# EAGLE design Driver-v1 (EAGLE 8.4.2)
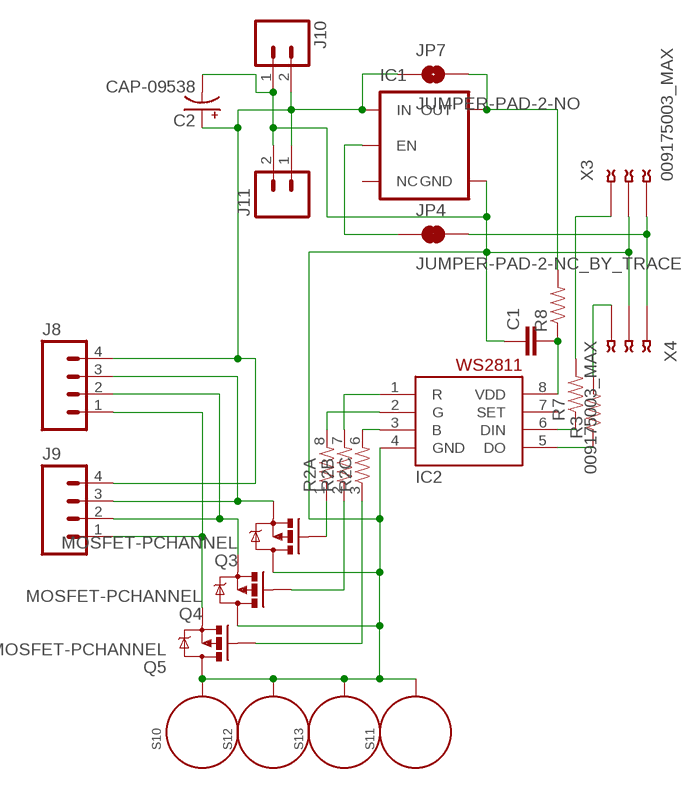
[diagram p0: schematic, sheet 1]

## Parts
C1  CAP1206  [1206]
C2  CAP-09538  1000UF-25V(PTH)  [CPOL-RADIAL-1000UF-25V]
IC1  V_REG_TPS76433SOT23-5  [SOT23-5]
IC2  WS2811-SOP8  [SO08-SKINNYPADS]
J8  M04LONGPADS  [1X04_LONGPADS]
J9  M04LONGPADS  [1X04_LONGPADS]
J10  M025MM  [SCREWTERMINAL-5MM-2]
J11  M025MM  [SCREWTERMINAL-5MM-2]
JP4  JUMPER-PAD-2-NC_BY_TRACE  [PAD-JUMPER-2-NC_BY_TRACE_YES_SILK]
JP7  JUMPER-PAD-2-NO  [PAD-JUMPER-2-NO_NO_SILK]
Q3  MOSFET-PCHANNEL  [SOT23-3]
Q4  MOSFET-PCHANNEL  [SOT23-3]
Q5  MOSFET-PCHANNEL  [SOT23-3]
R2  RESISTOR-ARRAY0603-ARV  [0603-ARV]
R3  RESISTOR0603  [0603-RES]
R7  RESISTOR0603  [0603-RES]
R8  RESISTOR0805-RES  [0805]
S10  STANDOFF_ELECTRICAL  [STANDOFF-ELECTRICAL]
S11  STANDOFF_ELECTRICAL  [STANDOFF-ELECTRICAL]
S12  STANDOFF_ELECTRICAL  [STANDOFF-ELECTRICAL]
S13  STANDOFF_ELECTRICAL  [STANDOFF-ELECTRICAL]
X3  009175003_MAX  [009175003_MAX]
X4  009175003_MAX  [009175003_MAX]

## Nets
GND2: C1.1 C2.- IC1.2(GND) IC2.4(GND) J10.1 J11.2 Q3.3(D) Q4.3(D) Q5.3(D) S10.P1 S11.P1 S12.P1 S13.P1 X3.2 X3.2@1 X4.2 X4.2@1
N$17: J8.1 J9.1 Q5.2(S)
N$20: J8.2 J9.2 Q4.2(S)
N$21: J8.3 J9.3 Q3.2(S)
N$22: Q3.1(G) R2.1
N$24: Q4.1(G) R2.2
N$26: Q5.1(G) R2.3
N$27: JP4.2 X3.3 X3.3@2 X4.1 X4.1@1
N$28: IC1.3(EN) JP4.1
N$29: R7.2 X3.1 X3.1@1
N$30: IC2.5(DO) R3.1
N$31: IC2.3(B) R2.6
N$32: IC2.2(G) R2.8
N$33: IC2.1(R) R2.7
N$34: IC1.5(OUT) JP7.2 R8.2
N$35: IC2.6(DIN) R7.1
N$36: R3.2 X4.3 X4.3@2
N$37: C1.2 IC2.8(VDD) R8.1
VIN2: C2.+ IC1.1(IN) J8.4 J9.4 J10.2 J11.1 JP7.1
Unconnected: IC1.4(NC) IC2.7(SET) R2.4 R2.5

## Library data of the parts
C1 = SparkFun-Passives:CAP: Capacitor Standard 0603 ceramic capacitor, and 0.1" leaded capacitor.
C2 = SparkFun-Capacitors:1000UF-25V(PTH): CAP-08070; PROD_ID: CAP-09538
IC1 = SparkFun-PowerIC:V_REG_TPS76433: Voltage Regulator Older TI part. LDO 150mA regulator. No output by-pass cap option. See V_REG_LDO for a better part.
IC2 = adafruit:WS2811
J8 J9 = SparkFun-Connectors:M04: Header 4 Standard 4-pin 0.1" header. Use with straight break away headers (SKU : PRT-00116), right angle break away headers (PRT-00553), swiss pins (PRT-00743), machine pins (PRT-00117), and female headers (PRT-00115). Molex polarized connector foot print use with SKU : PRT-08231 with associated crimp pins and housings. 1MM SMD Version SKU: PRT-10208; PROD_ID: CONN-09696
J10 J11 = SparkFun-Connectors:M02: Standard 2-pin 0.1" header. Use with - straight break away headers ( PRT-00116) - right angle break away headers (PRT-00553) - swiss pins (PRT-00743) - machine pins (PRT-00117) - female headers (PRT-00115) Molex polarized connector foot print use with: PRT-08233 with associated crimp pins and housings. 2.54_SCREWTERM for use with PRT-10571. 3.5mm Screw Terminal footprints for PRT-08084 5mm Screw Terminal footprints for use with PRT-08432; STOREFRONT_ID: PRT-08432
JP4 = SparkFun-Passives:JUMPER-PAD-2-NC_BY_TRACE
JP7 = SparkFun-Passives:JUMPER-PAD-2-NO
Q3-Q5 = SparkFun-DiscreteSemi:MOSFET-PCHANNEL: Generic PMOSFET IRLML2244 - TRANS-11153 (SOT-23 -20V -4.3A) (1.Gate 2.Source 3.Drain) FQP27P06 - COM-10349 <http://www.sparkfun.com/products/10349> (TO-220 -60V -27A) (1.Gate 2.Source 3.Drain); PROD_ID: TRANS-08285
R2 = SparkFun-Resistors:RESISTOR-ARRAY: Array Chip Resistor Source: RS Component / Phycomp
R3 R7 R8 = SparkFun-Resistors:RESISTOR: Resistor Basic schematic elements and footprints for 0603, 1206, and PTH resistors.
S10-S13 = SparkFun-Electromechanical:STANDOFF_ELECTRICAL: A standoff intended to be an electrically connected point. Pad size and stop size allow for a #4 Phillips pan screw head to make a solid connection to the board.
X3 X4 = con-avx:009175003_MAX: Wire to Board IDC Connector 3 WAY Source: http://www.avx.com/docs/Catalogs/9175.pdf

## Board
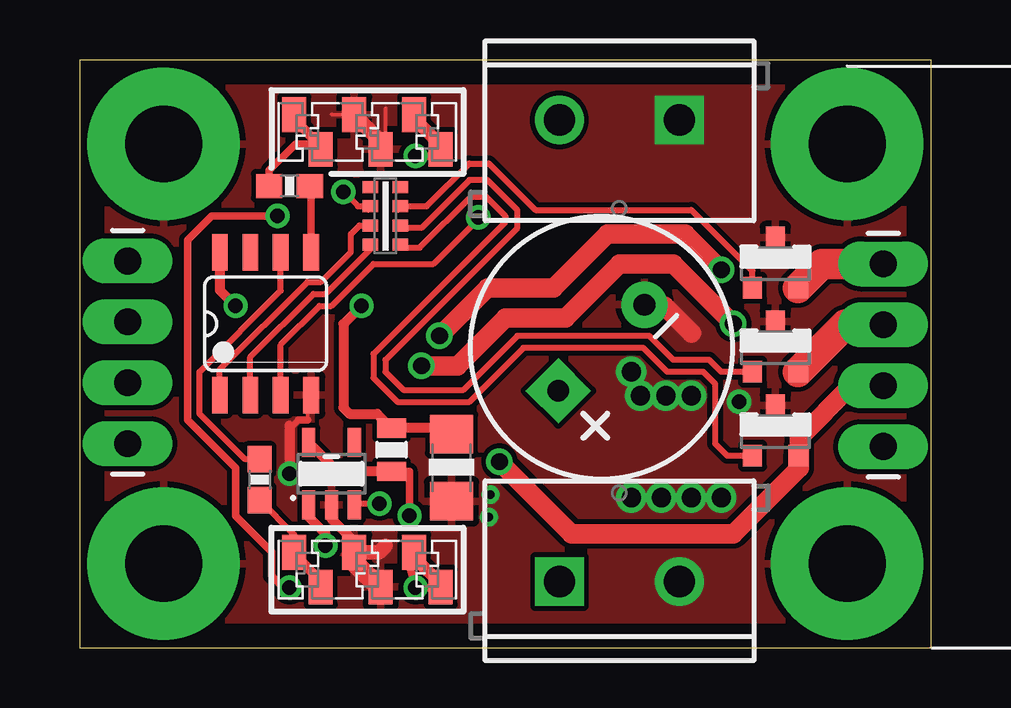
[diagram p1: board, top side]
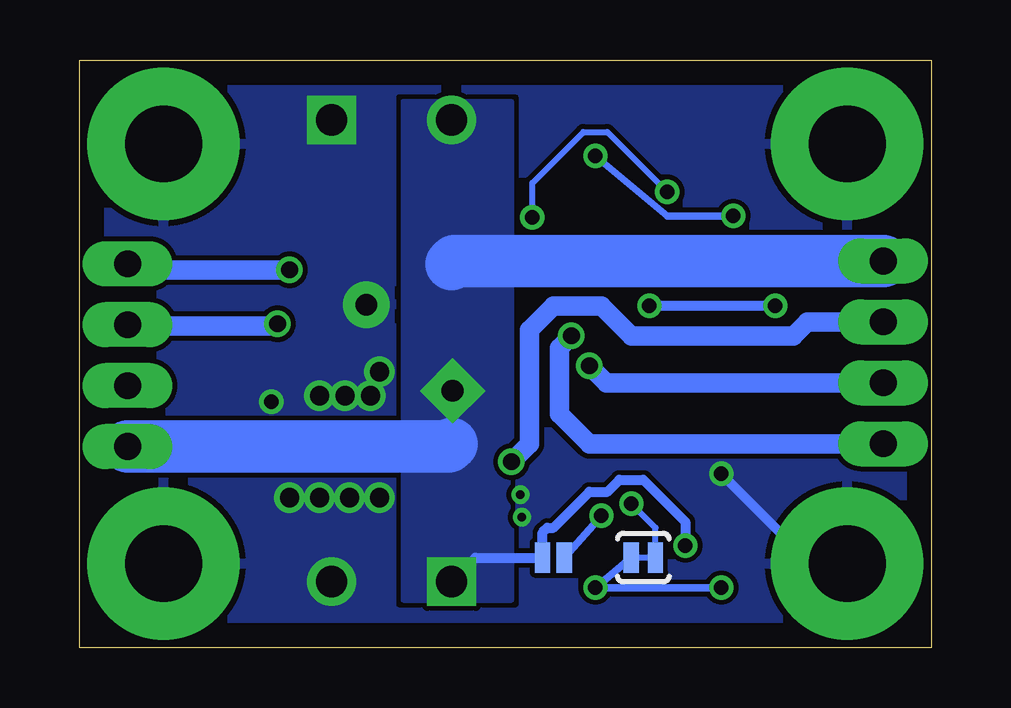
[diagram p2: board, bottom side, seen from below]

Size 35.5 x 24.5 mm. Coordinates in mm from the lower left corner, seen from the top.
Outline: 0,0 35.5,0 35.5,24.5 0,24.5 0,0
Copper layers (1*16): Top 0.035mm / dielectric 1.5mm / Bottom 0.035mm
Design rules "default *": minimum track width 10mil, minimum drill 24mil, track to track 8mil, track to pad 8mil, pad to pad 8mil, via to via 8mil, smd to smd 8mil, copper to edge 40mil, drill to drill 8mil, minimum pad ring 10mil, minimum via ring 8mil, stop-mask expansion 4mil, vias tented up to drill 0.7mm, thermal gap 10mil

### Footprints (pad centres in the part's own frame; a part is rotated, then mirrored left to right if it is on the bottom)
1206 = smd 1.6 x 1.8: 1 -1.4,0; 2 1.4,0
CPOL-RADIAL-1000UF-25V = drill 0.9 pad 1.93 square: + 2.54,0 | drill 0.9 pad 1.93: - -2.54,0
SOT23-5 = smd 0.55 x 1.2: 1 -0.95,-1.3; 2 0,-1.3; 3 0.95,-1.3; 4 0.95,1.3; 5 -0.95,1.3
SO08-SKINNYPADS = smd 0.66 x 1.524: 1 -1.905,-2.973; 2 -0.635,-2.973; 3 0.635,-2.973; 4 1.905,-2.973; 5 1.905,2.973; 6 0.635,2.973; 7 -0.635,2.973; 8 -1.905,2.973
1X04_LONGPADS = drill 1.118 pad 1.88 long: 1 0,0; 2 2.54,0; 3 5.08,0; 4 7.62,0
SCREWTERMINAL-5MM-2 = drill 1.3 pad 2.032 square: 1 0,0 | drill 1.3 pad 2.032: 2 5,0
PAD-JUMPER-2-NC_BY_TRACE_YES_SILK = smd 0.635 x 1.27: 1 -0.508,0; 2 0.508,0
PAD-JUMPER-2-NO_NO_SILK = smd 0.635 x 1.27: 1 -0.45,0; 2 0.45,0
SOT23-3 = smd 0.8 x 0.9: 1 -0.95,-1; 2 0.95,-1; 3 0,1.1
0603-ARV = smd 0.5 x 0.65: 1 -1.2,-0.625; 2 -0.4,-0.625; 3 0.4,-0.625; 4 1.2,-0.625; 5 1.2,0.625; 6 0.4,0.625; 7 -0.4,0.625; 8 -1.2,0.625
0603-RES = smd 1.1 x 1: 1 -0.85,0; 2 0.85,0
0805 = smd 0.8 x 1.2: 1 -0.9,0; 2 0.9,0
STANDOFF-ELECTRICAL = drill 3.2 pad 6.35: P1 0,0
009175003_MAX = smd 1 x 1.45: 1 -3.05,0.725; 1@1 -1.95,-0.725; 2 -0.55,0.725; 2@1 0.55,-0.725; 3 1.95,0.725; 3@2 3.05,-0.725

### Placement (x,y rotation side)
C1  15.5,7.5 90 top
C2  21.75,12.5 225 top
IC1  10.5,7.25 0 top
IC2  7.75,13.5 0 top
J8  2,8.5 90 top
J9  33.5,16 270 top
J10  25,22 180 top
J11  20,2.75 0 top
JP4  12,3.75 180 bottom
JP7  15.75,3.75 0 bottom
Q3  29,9 0 top
Q4  29,12.5 0 top
Q5  29,16 0 top
R2  12.75,18 90 top
R3  8.75,19.25 180 top
R7  7.5,7 270 top
R8  13,8.25 270 top
S10  32,21 0 top
S11  32,3.5 0 top
S12  3.5,3.5 0 top
S13  3.5,21 180 top
X3  12,3.25 0 top
X4  12,21.5 180 top

### Tracks (layer width: path | path; a pad name or v marks a point on that pad's centre or on a via)
GND2  (via drill 0.35, 0.6, 0.6 pad 1.02, 0.8 pad 1.27)
  Top 0.152: X4.2@1 10.53,22.23 10.5,22.25 | IC2.4 9.5,10.37 9.5,9.5 | X4.2 12.75,20.98 12.75,22.5
  Top 0.254: 9.12,9.5 8.88,9.25 8.75,9.25
  Top 0.305: 9.5,9.5 9.12,9.5
  Top 0.406: 8.75,9.25 v8.75,7.25 | IC1.2 10.5,5.38 11.25,4.62 11.25,4.17 X3.2
  Top 0.61: X3.2 12.47,3.98 12.75,4.25 | X4.2 12.55,21.12 X4.2@1
  Top 0.813: X3.2@1 12.47,2.52 11.5,3.5 11.5,3.92 X3.2 | 23.5,14.25 24.38,14.25 25.5,13.12
  Bottom 0.406: v8.75,7.25 5,3.5 S12.P1
  other vias: 24.25,6.25 23,6.25 26.75,6.25 25.5,6.25 23.38,10.5 24.44,10.5 25.5,10.5 23,11.5 27.5,10.25 17.12,6.38 17.06,5.44
  pour Top (rank 2): -2,26.5 38,28 38,-2.5 -2,-2
  pour Bottom (rank 2): -2,26.5 38,28 38,-2.25 -2,-2
  pour Bottom (rank 2, no thermals): 23.5,23.5 26.5,23.5 26.5,20.5 23.5,20.5
  pour Top (rank 2, no thermals): 26.5,23.5 23.5,23.5 23.5,20.5 26.5,20.5
  pour Top (rank 2, no thermals): 26.5,4.12 23.5,4.12 23.5,1.12 26.5,1.12
  pour Bottom (rank 2, no thermals): 23.5,4.12 26.5,4.12 26.5,1.12 23.5,1.12
  pour Bottom (no thermals): 22.5,15.62 22.5,13 25,13 25,15.62
N$17  (via drill 0.7)
  Top 0.813: v15,13 17,15 19.75,15 22,17.25 25.25,17.25 v26.75,15.75
  Top 1.27: J9.1 30.95,16 Q5.2
  Bottom 0.813: J8.1 14.25,8.5 15.5,9.75 15.5,12.5 v15,13 | v26.75,15.75 33,15.75 J9.1
N$20  (via drill 0.7)
  Top 0.813: v14.25,11.75 15.75,11.75 17.75,13.75 20.25,13.75 22.5,16 24.75,16 v27.25,13.5
  Top 1.27: J9.2 31.91,13.46 Q4.2
  Bottom 0.813: J8.2 13.54,11.04 v14.25,11.75 | 33.04,13 J9.2 31.91,13.46 33.1,13.4 | 33.35,13.4 33.1,13.4 | 33.1,13.4 27.35,13.4 v27.25,13.5
N$21  (via drill 0.7)
  Top 0.813: v17.5,7.75 20.5,4.75 27.25,4.75 30,7.5 30,7.95 Q3.2 30,8.05 30,8.75 32.17,10.92 J9.3
  Bottom 0.813: J8.3 5.17,13.58 5.75,13 12.5,13 13.75,14.25 15.75,14.25 16.75,13.25 16.75,8.5 v17.5,7.75
N$22
  Top 0.254: Q3.1 27,8 26.5,8.5 26.5,11 26,11.5 24.5,11.5 23.5,12.5 18.5,12.5 16.25,10.25 13.25,10.25 12.25,11.25 12.25,12.25 17.75,17.75 17.75,18 16.94,18.81 16.31,18.81 14.18,16.68 13.25,16.68 R2.1
N$24
  Top 0.254: Q4.1 26.75,11.5 26.25,12 24.75,12 23.75,13 18.25,13 16,10.75 13.5,10.75 12.75,11.5 12.75,12 18.25,17.5 18.25,18.25 17,19.5 16.25,19.5 14.25,17.5 13.47,17.5 R2.2 13.22,17.5
N$26
  Top 0.254: Q5.1 28.05,15.7 25.5,18.25 19,18.25 17.06,20.19 16.25,20.19 14.46,18.4 R2.3 13.28,18.25
N$27  (via drill 0.6)
  Top 0.305: X3.3@2 13.95,3.62 | 13.95,3.62 X3.3 13.95,3.7 15.25,2.5 v14,2.5 13.75,3.42 13.95,3.62 | v8.75,2.5 8.5,2.5 8,3 8,4 6.5,5.5 6.5,7.5 4.5,9.5 4.5,17 5.5,18 v8.25,18 | X4.1 14.78,20.5 v14,20.5 14.75,20.5 15.25,21 15.18,21 X4.1@1
  Bottom 0.305: JP4.2 v14,2.5 v8.75,2.5 | v8.25,18 11,18 v14,20.5
N$28  (via drill 0.6)
  Top 0.254: v12.5,6 11.5,6 IC1.3
  Bottom 0.254: JP4.1 11.49,4.99 v12.5,6
N$29
  Top 0.254: X3.1@1 10.05,2.88 X3.1 8.95,4.7 R7.2
N$30
  Top 0.305: IC2.5 9.65,18.8 R3.1
N$31  (via drill 0.6 pad 1.02)
  Top 0.254: IC2.3 8.38,12.63 10,14.25 10.5,14.25 12.25,16 14.75,16 16.69,17.94 v16.62,17.94 | 12.03,18.25 R2.6 11.6,18.4 v11,19
  Bottom 0.254: v16.62,17.94 16.62,19.38 14.5,21.5 13.5,21.5 v11,19
N$32
  Top 0.254: IC2.2 7.12,12.12 9.75,14.75 10.25,14.75 12.12,16.62 R2.8
N$33
  Top 0.254: IC2.1 5.84,11.6 9.5,15.25 10.06,15.25 11.31,16.5 11.31,17.25 11.66,17.6 R2.7
N$34  (via drill 0.6)
  Top 0.305: R8.2 13.75,7.35 v13.75,5.5
  Top 0.406: R8.2 10.75,7.35 IC1.5
  Bottom 0.305: v13.75,5.5 15.25,3.8 JP7.2
N$35
  Top 0.254: IC2.6 8.38,14.88 5,11.5 5,9.75 6.9,7.85 R7.1
N$36
  Top 0.254: X4.3@2 8.95,22.12 X4.3
  Top 0.305: R3.2 7.9,19.9 9,21 10.03,21 X4.3
N$37  (via drill 0.6)
  Top 0.406: IC2.8 5.84,14.9 v6.5,14.25 | v11.75,14.25 11,13.5 11,10 11.25,9.75 12.4,9.75 R8.1 15.25,9.15 C1.2
  Bottom 0.406: v6.5,14.25 v11.75,14.25
VIN2  (via drill 0.6)
  Top 0.406: v10.25,4.25 10.25,4.75 9.5,5.5 9.5,5.9 IC1.1
  Bottom 0.406: v10.25,4.25 10.25,5.25 12,7 13,7 13.5,6.5 14.25,6.5 15.75,5 16,5 16.2,4.8 JP7.1 19,3.75 J11.1
  Bottom 2.184: J9.4 20.12,8.38 20,8.5 | J8.4 19.88,16.12 20,16
  pour Bottom (no thermals): 22,22.75 22,2 17.5,2 17.5,22.75